# EAGLE schematic Oskar.Kuchejda (EAGLE 9.6.2)
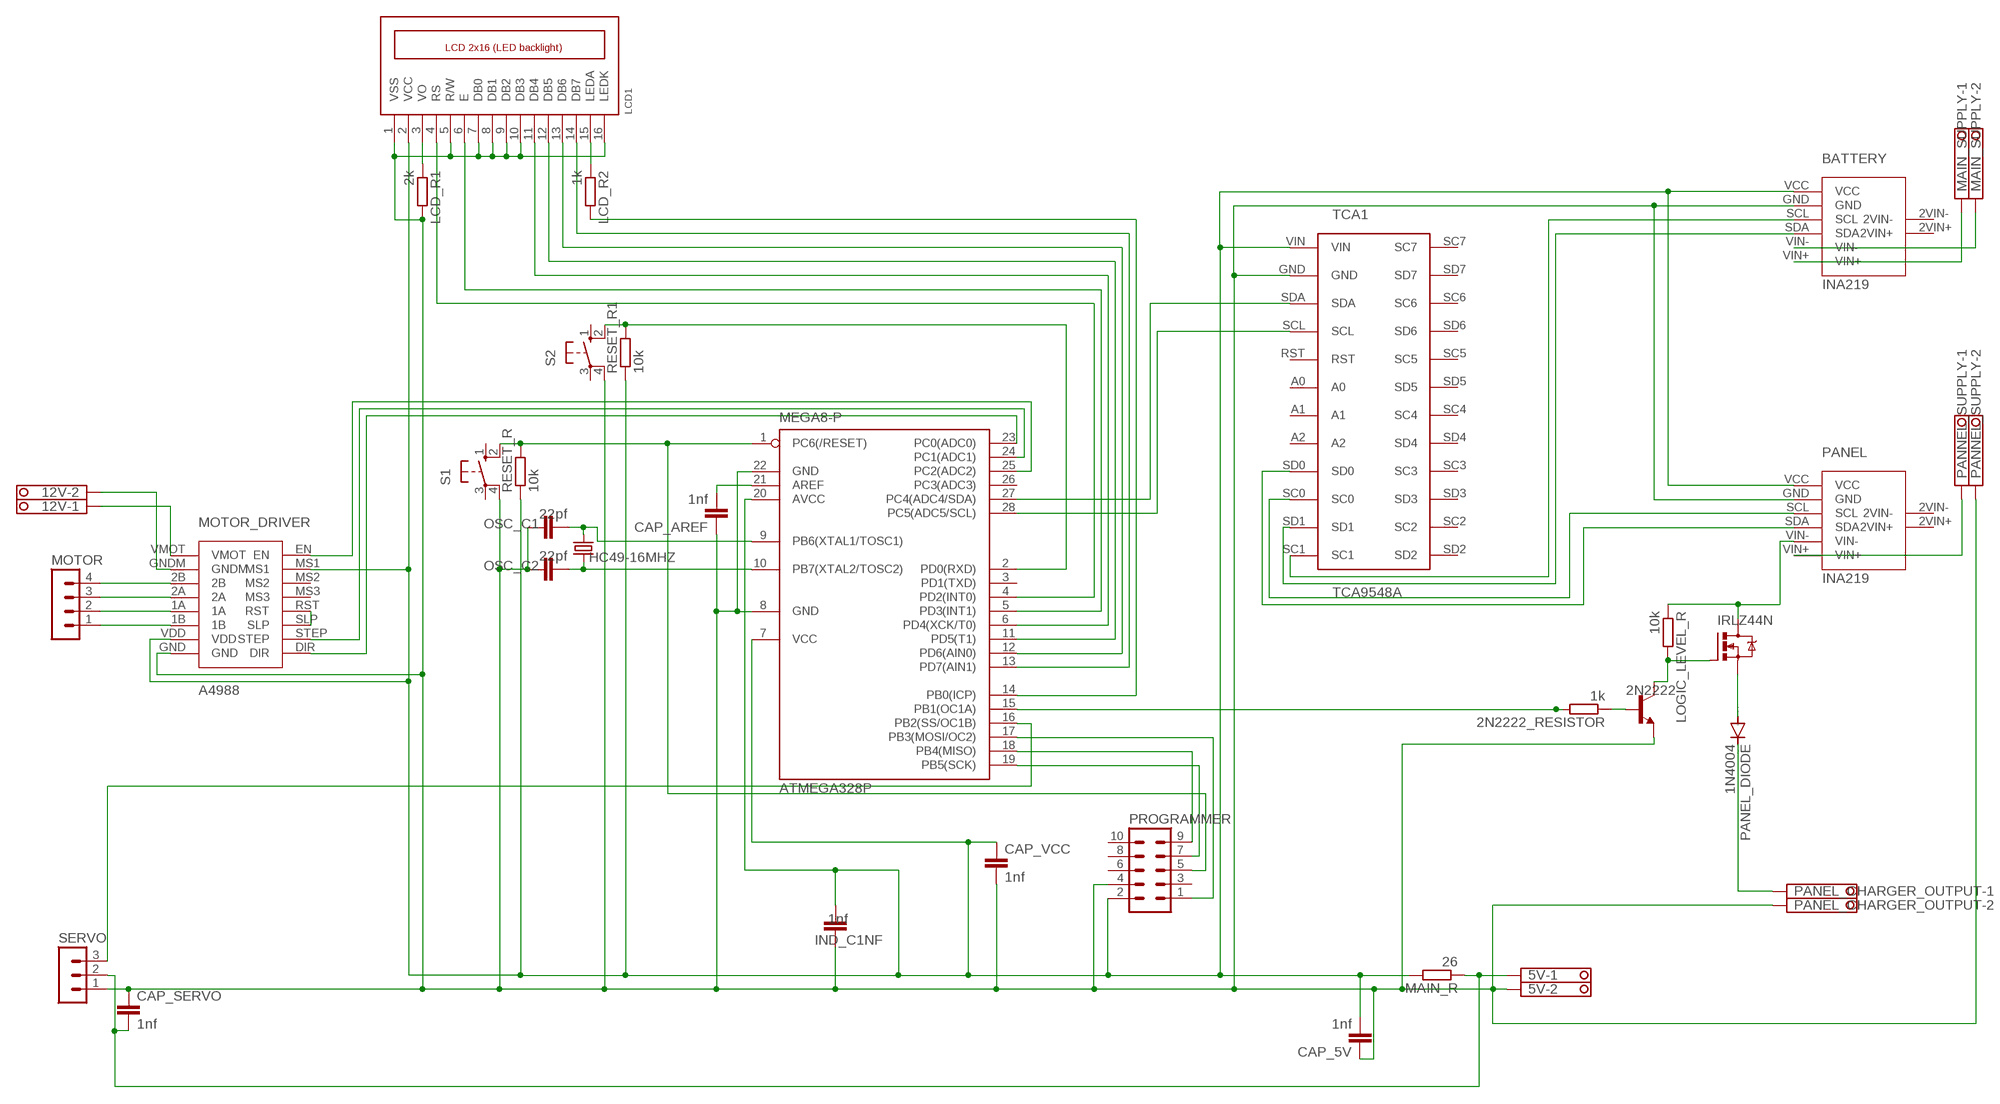
[diagram p0: schematic, sheet 1]

## Parts
2N2222_RESISTOR  1k  R-EU_0207/2V  [0207/2V]
5V  TERMINAL-BLOCK-3.5MM-2-PIN-ROUND-PAD  [TERMINAL-BLOCK-2-PIN-3.5MM-ROUND-PAD]
12V  TERMINAL-BLOCK-3.5MM-2-PIN-ROUND-PAD  [TERMINAL-BLOCK-2-PIN-3.5MM-ROUND-PAD]
ATMEGA328P  MEGA8-P  [DIL28-3]
BATTERY  INA219  [INA219]
CAP_5V  1nf  C-EU025-024X044  [C025-024X044]
CAP_AREF  1nf  C-EU025-024X044  [C025-024X044]
CAP_SERVO  1nf  C-EU025-024X044  [C025-024X044]
CAP_VCC  1nf  C-EU025-024X044  [C025-024X044]
HC49-16MHZ  CRYTALHC49S  [HC49/S]
IND_C1NF  1nf  C-EU025-024X044  [C025-024X044]
IRLZ44N  IRF540  [TO220BV]
LCD1  LCD_2X16_SIL  [HY-1602F]
LCD_R1  2k  R-EU_0207/2V  [0207/2V]
LCD_R2  1k  R-EU_0207/2V  [0207/2V]
LOGIC_LEVEL_R  10k  R-EU_0207/2V  [0207/2V]
MAIN_R  26  R-EU_0207/2V  [0207/2V]
MAIN_SUPPLY  TERMINAL-BLOCK-3.5MM-2-PIN-ROUND-PAD  [TERMINAL-BLOCK-2-PIN-3.5MM-ROUND-PAD]
MOTOR  MA04-1  [MA04-1]
MOTOR_DRIVER  A4988  [A4988]
OSC_C1  22pf  C-EU025-024X044  [C025-024X044]
OSC_C2  22pf  C-EU025-024X044  [C025-024X044]
PANEL  INA219  [INA219]
PANEL_CHARGER_OUTPUT  TERMINAL-BLOCK-3.5MM-2-PIN-ROUND-PAD  [TERMINAL-BLOCK-2-PIN-3.5MM-ROUND-PAD]
PANEL_DIODE  1N4004  [DO41-10]
PANNEL_SUPPLY  TERMINAL-BLOCK-3.5MM-2-PIN-ROUND-PAD  [TERMINAL-BLOCK-2-PIN-3.5MM-ROUND-PAD]
PROGRAMMER  MA05-2  [MA05-2]
RESET_R  10k  R-EU_0207/2V  [0207/2V]
RESET_R1  10k  R-EU_0207/2V  [0207/2V]
S1  10-XX  [B3F-10XX]
S2  10-XX  [B3F-10XX]
SERVO  MA03-1  [MA03-1]
T1  2N2222  [TO92-EBC-OVAL]
TCA1  TCA9548A  [TCA9548A]

## Nets
5V: ATMEGA328P.7(VCC) ATMEGA328P.20(AVCC) BATTERY.VCC CAP_5V.2 CAP_VCC.1 IND_C1NF.2 LCD1.2(VCC) MAIN_R.2 MOTOR_DRIVER.MS1 MOTOR_DRIVER.VDD PANEL.VCC PROGRAMMER.2 RESET_R1.1 RESET_R.1 TCA1.VIN
GND: 5V.2 ATMEGA328P.8(GND) ATMEGA328P.22(GND) BATTERY.GND CAP_5V.1 CAP_AREF.1 CAP_SERVO.1 CAP_VCC.2 IND_C1NF.1 LCD1.1(VSS) LCD1.5(R/W) LCD1.7(DB0) LCD1.8(DB1) LCD1.9(DB2) LCD1.10(DB3) LCD1.16(LEDK) LCD_R1.2 MOTOR_DRIVER.GND OSC_C1.1 OSC_C2.1 PANEL.GND PANEL_CHARGER_OUTPUT.2 PANNEL_SUPPLY.2 PROGRAMMER.4 S1.4(P1) S2.4(P1) SERVO.1 T1.E TCA1.GND
N$1: BATTERY.SCL TCA1.SC1
N$2: ATMEGA328P.9(PB6(XTAL1/TOSC1)) HC49-16MHZ.1 OSC_C1.2
N$3: ATMEGA328P.10(PB7(XTAL2/TOSC2)) HC49-16MHZ.2 OSC_C2.2
N$4: 2N2222_RESISTOR.2 ATMEGA328P.15(PB1(OC1A))
N$5: ATMEGA328P.16(PB2(SS/OC1B)) SERVO.3
N$6: 5V.1 CAP_SERVO.2 MAIN_R.1 SERVO.2
N$7: BATTERY.SDA TCA1.SD1
N$8: ATMEGA328P.6(PD4(XCK/T0)) LCD1.11(DB4)
N$9: MOTOR.1 MOTOR_DRIVER.1B
N$10: MOTOR.2 MOTOR_DRIVER.1A
N$11: ATMEGA328P.11(PD5(T1)) LCD1.12(DB5)
N$12: ATMEGA328P.12(PD6(AIN0)) LCD1.13(DB6)
N$13: ATMEGA328P.13(PD7(AIN1)) LCD1.14(DB7)
N$14: PANEL.SDA TCA1.SD0
N$15: PANEL.SCL TCA1.SC0
N$16: MOTOR.3 MOTOR_DRIVER.2A
N$17: PANEL.VIN+ PANNEL_SUPPLY.1
N$18: ATMEGA328P.4(PD2(INT0)) LCD1.4(RS)
N$19: BATTERY.VIN+ MAIN_SUPPLY.1
N$20: ATMEGA328P.27(PC4(ADC4/SDA)) TCA1.SDA
N$21: ATMEGA328P.28(PC5(ADC5/SCL)) TCA1.SCL
N$22: BATTERY.VIN- MAIN_SUPPLY.2
N$23: IRLZ44N.D LOGIC_LEVEL_R.1 PANEL.VIN-
N$24: ATMEGA328P.14(PB0(ICP)) LCD_R2.2
N$25: ATMEGA328P.21(AREF) CAP_AREF.2
N$26: ATMEGA328P.1(PC6(/RESET)) PROGRAMMER.5 RESET_R.2 S1.2(S1)
N$27: MOTOR.4 MOTOR_DRIVER.2B
N$28: IRLZ44N.G LOGIC_LEVEL_R.2 T1.C
N$29: 12V.2 MOTOR_DRIVER.GNDM
N$30: 12V.1 MOTOR_DRIVER.VMOT
N$31: MOTOR_DRIVER.RST MOTOR_DRIVER.SLP
N$32: ATMEGA328P.23(PC0(ADC0)) MOTOR_DRIVER.DIR
N$33: ATMEGA328P.24(PC1(ADC1)) MOTOR_DRIVER.STEP
N$34: ATMEGA328P.25(PC2(ADC2)) MOTOR_DRIVER.EN
N$35: 2N2222_RESISTOR.1 T1.B
N$36: ATMEGA328P.2(PD0(RXD)) RESET_R1.2 S2.2(S1)
N$38: PANEL_CHARGER_OUTPUT.1 PANEL_DIODE.C
N$39: IRLZ44N.S PANEL_DIODE.A
N$40: LCD1.15(LEDA) LCD_R2.1
N$41: ATMEGA328P.17(PB3(MOSI/OC2)) PROGRAMMER.1
N$43: ATMEGA328P.19(PB5(SCK)) PROGRAMMER.7
N$44: ATMEGA328P.18(PB4(MISO)) PROGRAMMER.9
N$45: ATMEGA328P.5(PD3(INT1)) LCD1.6(E)
N$47: LCD1.3(VO) LCD_R1.1
Unconnected: ATMEGA328P.3(PD1(TXD)) ATMEGA328P.26(PC3(ADC3)) BATTERY.2VIN+ BATTERY.2VIN- MOTOR_DRIVER.MS2 MOTOR_DRIVER.MS3 PANEL.2VIN+ PANEL.2VIN- PROGRAMMER.3 PROGRAMMER.6 PROGRAMMER.8 PROGRAMMER.10 S1.1(S) S1.3(P) S2.1(S) S2.3(P) TCA1.A0 TCA1.A1 TCA1.A2 TCA1.RST TCA1.SC2 TCA1.SC3 TCA1.SC4 TCA1.SC5 TCA1.SC6 TCA1.SC7 TCA1.SD2 TCA1.SD3 TCA1.SD4 TCA1.SD5 TCA1.SD6 TCA1.SD7

## Library data of the parts
2N2222_RESISTOR LCD_R1 LCD_R2 LOGIC_LEVEL_R MAIN_R RESET_R RESET_R1 = rcl:R-EU_: RESISTOR, European symbol; SPICEPREFIX: R
5V 12V MAIN_SUPPLY PANEL_CHARGER_OUTPUT PANNEL_SUPPLY = Rembrandt Electronics - Terminal Block 3-5mm v1-0:TERMINAL-BLOCK-3.5MM-2-PIN: Terminal Block 3.5mm Pitch: 3,5 mm Number of pins: 2 Created by Rembrandt Electronics www.rembrandtelectronics.com
ATMEGA328P = atmel:MEGA8-P: MICROCONTROLLER 8 Kbytes FLASH, 1 kbytes SRAM, 512 bytes EEPROM, USART, 4-channel 10 bit ADC, 2-channel 8 bit ADC Pin compatible with Atmega48, ATMega88, ATMega168 Source: avr.lbr; OC_FARNELL: unknown; OC_NEWARK: unknown
BATTERY PANEL = TrackerSłonecznyLIB:INA219
CAP_5V CAP_AREF CAP_SERVO CAP_VCC IND_C1NF OSC_C1 OSC_C2 = rcl:C-EU: CAPACITOR, European symbol; SPICEPREFIX: C
HC49-16MHZ = crystal:CRYTAL: CRYSTAL
IRLZ44N = transistor-power:IRF540: HEXFET Power MOSFET
LCD1 = lcd_2x16_led_backlight:LCD_2X16_SIL
MOTOR = con-lstb:MA04-1: PIN HEADER; OC_FARNELL: unknown; OC_NEWARK: unknown
MOTOR_DRIVER = TrackerSłonecznyLIB:A4988
PANEL_DIODE = diode:1N4004: DIODE general purpose rectifier, 1 A
PROGRAMMER = con-lstb:MA05-2: PIN HEADER; OC_FARNELL: unknown; OC_NEWARK: unknown
S1 S2 = switch-omron:10-XX: OMRON SWITCH; MPN: B3F-1000; OC_FARNELL: 176432; OC_NEWARK: 36M3542
SERVO = con-lstb:MA03-1: PIN HEADER; OC_FARNELL: unknown; OC_NEWARK: unknown
T1 = adafruit:2N2222: NPN TRANSISTOR Big oval pads
TCA1 = TrackerSłonecznyLIB:TCA9548A